# EAGLE design thermometer (EAGLE 7.2.0)
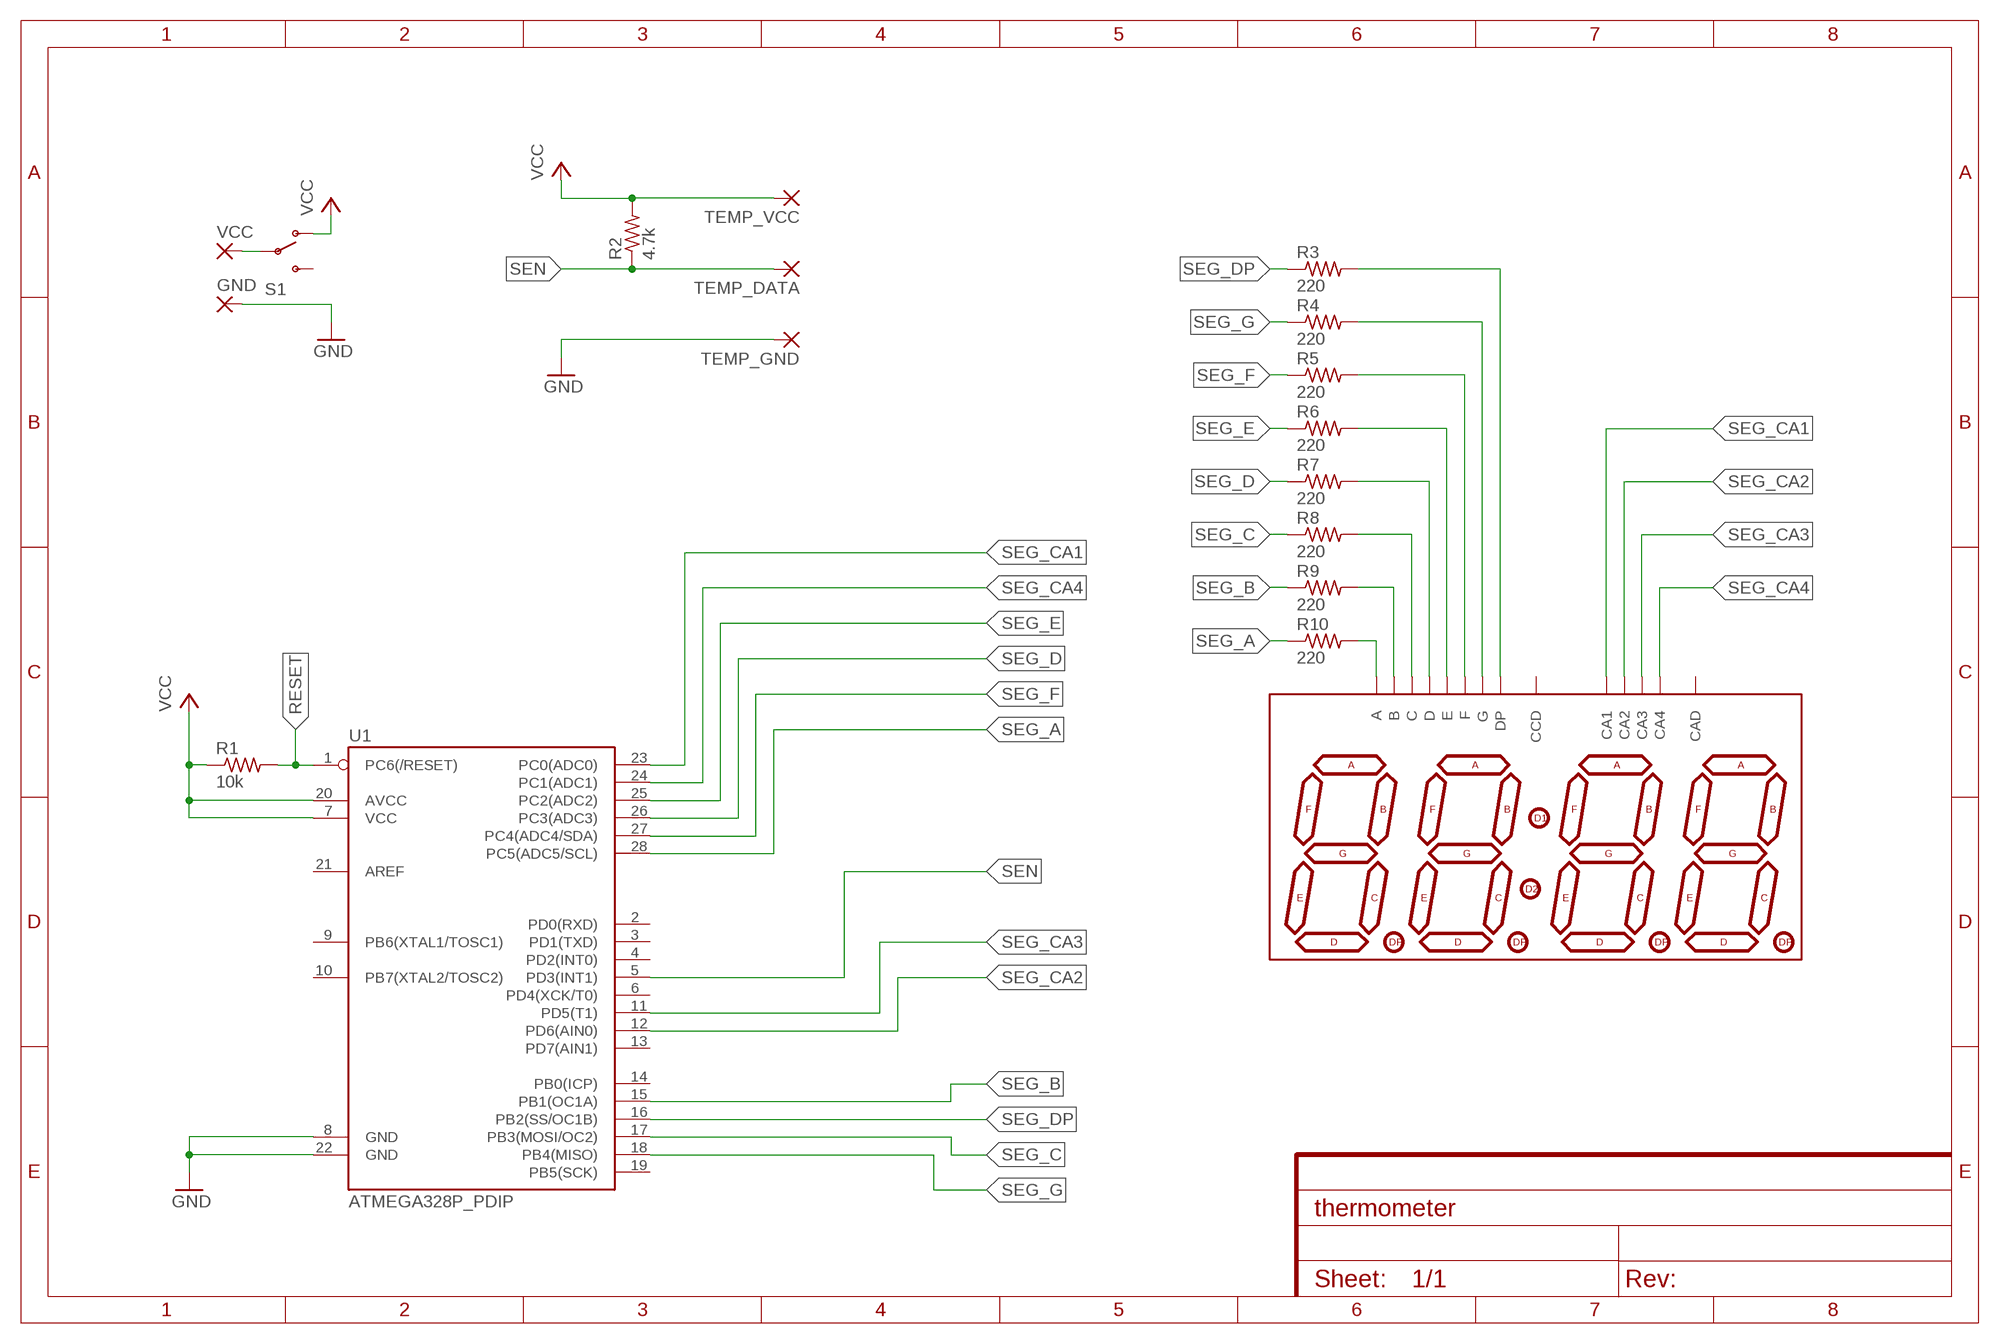
[diagram p0: schematic, sheet 1]
FRAME1 (FRAME-A4L): CNAME: Juraj Kostolansky; CREVISION: A; DESIGNER: www.kostolansky.sk

## Parts
GND  2,54/0,8  [2,54/0,8]
R1  10k  R-US_R0805  [R0805]
R2  4.7k  R-US_R0805  [R0805]
R3  220  R-US_R0805  [R0805]
R4  220  R-US_R0805  [R0805]
R5  220  R-US_R0805  [R0805]
R6  220  R-US_R0805  [R0805]
R7  220  R-US_R0805  [R0805]
R8  220  R-US_R0805  [R0805]
R9  220  R-US_R0805  [R0805]
R10  220  R-US_R0805  [R0805]
S1  SWITCH-SPDTPTH  [SWITCH-SPDT]
TEMP_DATA  2,54/0,8  [2,54/0,8]
TEMP_GND  2,54/0,8  [2,54/0,8]
TEMP_VCC  2,54/0,8  [2,54/0,8]
U1  ATMEGA328P_PDIP  [DIL28-3]
U2  5461BSDIP14  [5461BS]
VCC  2,54/0,8  [2,54/0,8]

## Nets
GND: GND.1(P) TEMP_GND.1(P) U1.8(GND) U1.22(GND)
N$1: R10.2 U2.A
N$2: R9.2 U2.B
N$3: R7.2 U2.D
N$4: R8.2 U2.C
N$5: R6.2 U2.E
N$6: R5.2 U2.F
N$7: R4.2 U2.G
N$8: R3.2 U2.DP
N$10: S1.2(P) VCC.1(P)
RESET: R1.2 U1.1(PC6(/RESET))
SEG_A: R10.1 U1.28(PC5(ADC5/SCL))
SEG_B: R9.1 U1.15(PB1(OC1A))
SEG_C: R8.1 U1.17(PB3(MOSI/OC2))
SEG_CA1: U1.23(PC0(ADC0)) U2.CA1
SEG_CA2: U1.12(PD6(AIN0)) U2.CA2
SEG_CA3: U1.11(PD5(T1)) U2.CA3
SEG_CA4: U1.24(PC1(ADC1)) U2.CA4
SEG_D: R7.1 U1.26(PC3(ADC3))
SEG_DP: R3.1 U1.16(PB2(SS/OC1B))
SEG_E: R6.1 U1.25(PC2(ADC2))
SEG_F: R5.1 U1.27(PC4(ADC4/SDA))
SEG_G: R4.1 U1.18(PB4(MISO))
SEN: R2.1 TEMP_DATA.1(P) U1.5(PD3(INT1))
VCC: R1.1 R2.2 S1.1(O) TEMP_VCC.1(P) U1.7(VCC) U1.20(AVCC)
Unconnected: S1.3(S) U1.2(PD0(RXD)) U1.3(PD1(TXD)) U1.4(PD2(INT0)) U1.6(PD4(XCK/T0)) U1.9(PB6(XTAL1/TOSC1)) U1.10(PB7(XTAL2/TOSC2)) U1.13(PD7(AIN1)) U1.14(PB0(ICP)) U1.19(PB5(SCK)) U1.21(AREF) U2.CAD U2.CCD

## Library data of the parts
GND TEMP_DATA TEMP_GND TEMP_VCC VCC = wirepad:2,54/0,8: THROUGH-HOLE PAD
R1-R10 = rcl:R-US_: RESISTOR, American symbol
S1 = SparkFun-Electromechanical:SWITCH-SPDT: SPDT Switch Simple slide switch, Spark Fun Electronics SKU : COM-00102 DPDT SMT slide switch, AYZ0202, SWCH-08179
U1 = SparkFun-DigitalIC:ATMEGA328P_PDIP: uC used in the Arduino 32kb flash, 1k EEPROM, 2k SRAM This is the through-hole version of this chip.
U2 = display:5461BS

## Board
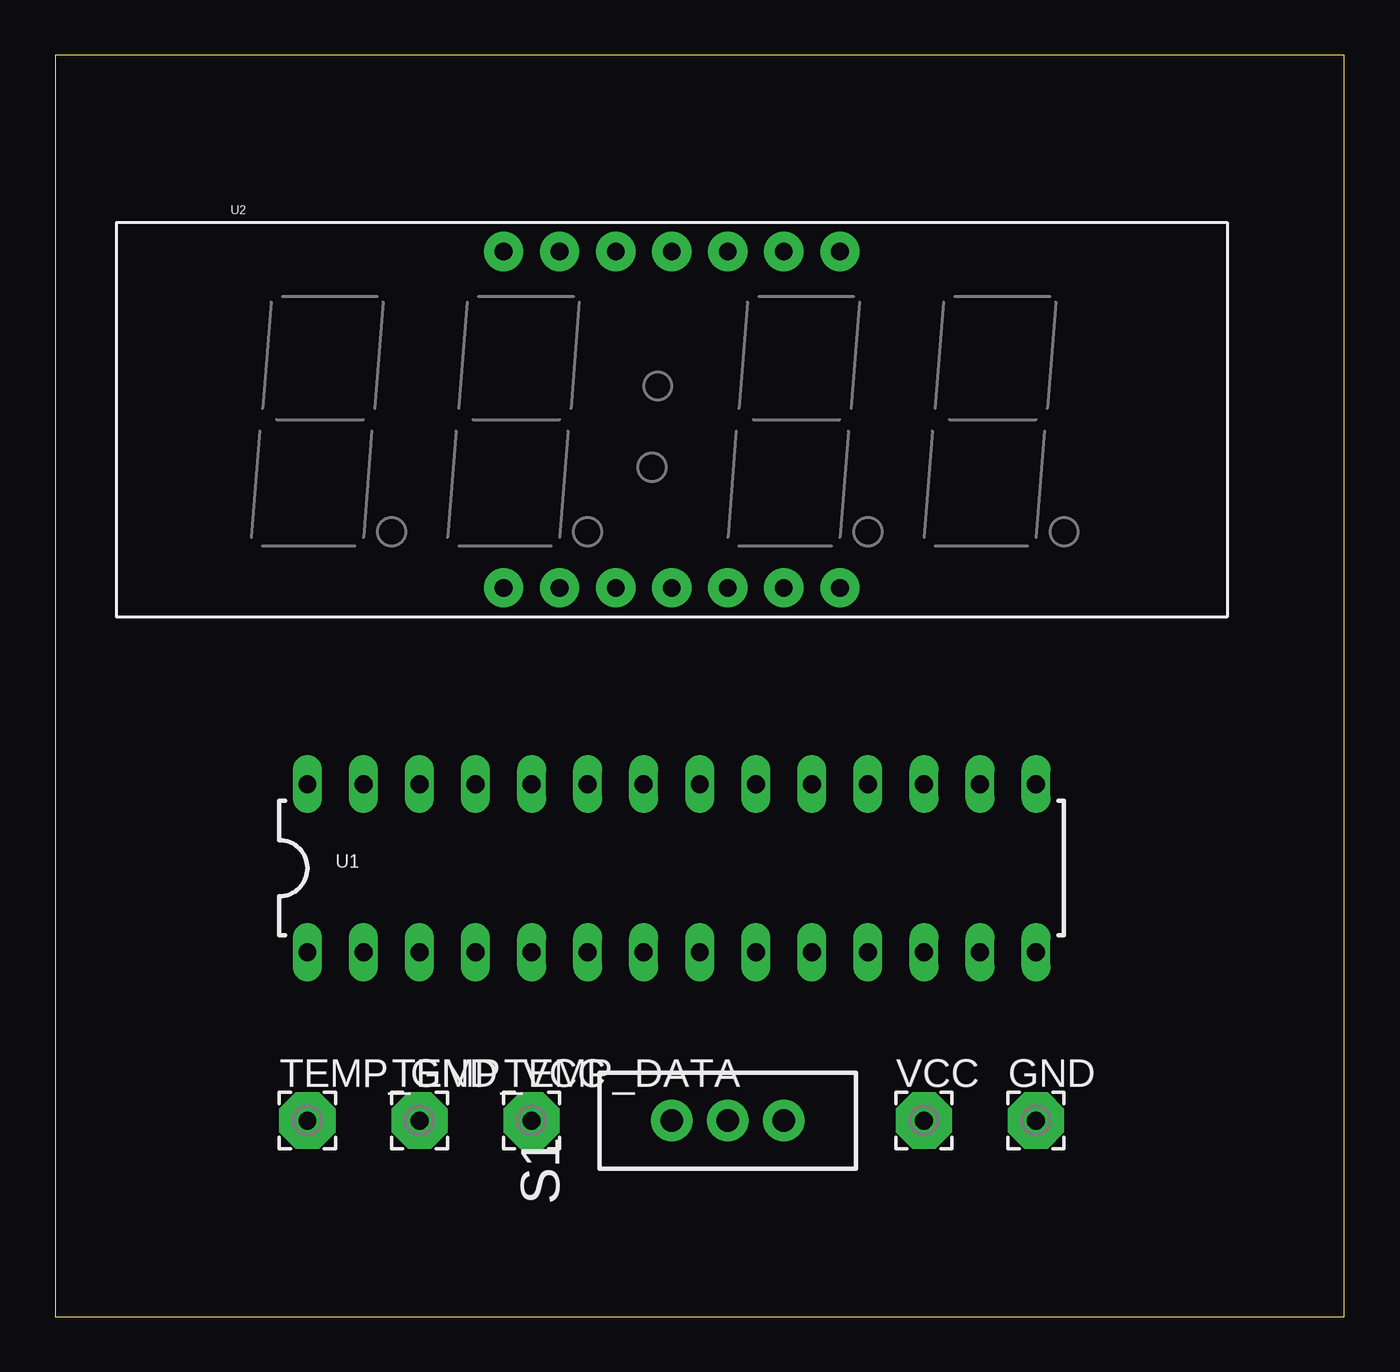
[diagram p1: board, top side]
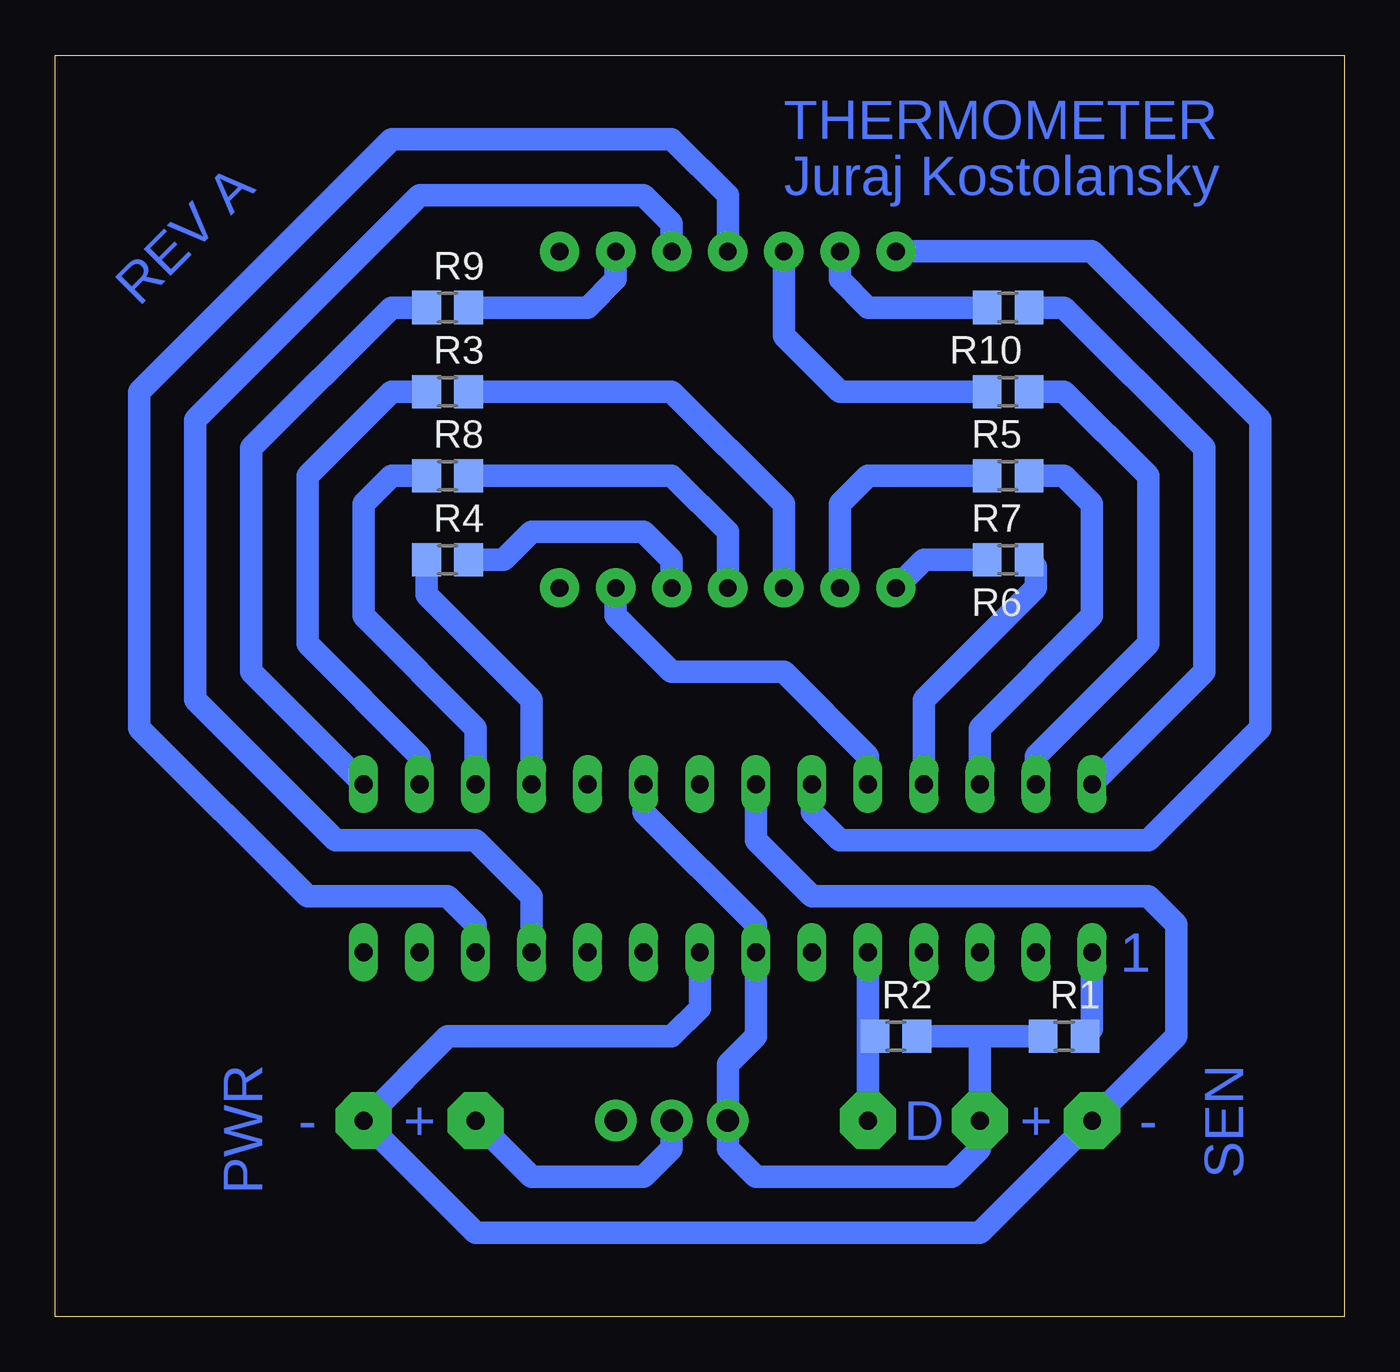
[diagram p2: board, bottom side, seen from below]

Size 58.42 x 57.15 mm. Coordinates in mm from the lower left corner, seen from the top.
Outline: 0,0 58.42,0 58.42,57.15 0,57.15 0,0
Copper layers (1*16): Top 0.035mm / dielectric 1.5mm / Bottom 0.035mm
Design rules "default *": minimum track width 16mil, minimum drill 24mil, track to track 16mil, track to pad 16mil, pad to pad 16mil, via to via 16mil, smd to smd 8mil, copper to edge 40mil, drill to drill 8mil, minimum pad ring 10mil, minimum via ring 8mil, stop-mask expansion 4mil, vias tented up to drill 0mil, thermal gap 10mil

### Footprints (pad centres in the part's own frame; a part is rotated, then mirrored left to right if it is on the bottom)
2,54/0,8 = drill 0.813 pad 2.54 octagon: 1 0,0
R0805 = smd 1.3 x 1.5: 1 -0.95,0; 2 0.95,0
SWITCH-SPDT = drill 1.016 pad 1.88: 1 0,2.54; 2 0,0; 3 0,-2.54
DIL28-3 = drill 0.813 long: 1 -16.51,-3.81; 2 -13.97,-3.81; 3 -11.43,-3.81; 4 -8.89,-3.81; 5 -6.35,-3.81; 6 -3.81,-3.81; 7 -1.27,-3.81; 8 1.27,-3.81; 9 3.81,-3.81; 10 6.35,-3.81; 11 8.89,-3.81; 12 11.43,-3.81; 13 13.97,-3.81; 14 16.51,-3.81; 15 16.51,3.81; 16 13.97,3.81; 17 11.43,3.81; 18 8.89,3.81; 19 6.35,3.81; 20 3.81,3.81; 21 1.27,3.81; 22 -1.27,3.81; 23 -3.81,3.81; 24 -6.35,3.81; 25 -8.89,3.81; 26 -11.43,3.81; 27 -13.97,3.81; 28 -16.51,3.81
5461BS = drill 0.8 pad 1.778: A -5.08,7.62; B 5.08,7.62; C 0,-7.62; CA1 -7.62,7.62; CA2 0,7.62; CA3 2.54,7.62; CA4 5.08,-7.62; CAD 7.62,-7.62; CCD 7.62,7.62; D -5.08,-7.62; DP -2.54,-7.62; E -7.62,-7.62; F -2.54,7.62; G 2.54,-7.62

### Placement (x,y rotation side)
GND  44.45,8.89 0 top
R1  12.7,12.7 0 bottom
R2  20.32,12.7 0 bottom
R3  40.64,41.91 0 bottom
R4  40.64,34.29 0 bottom
R5  15.24,41.91 180 bottom
R6  15.24,34.29 180 bottom
R7  15.24,38.1 180 bottom
R8  40.64,38.1 0 bottom
R9  40.64,45.72 0 bottom
R10  15.24,45.72 180 bottom
S1  30.48,8.89 90 top
TEMP_DATA  21.59,8.89 0 top
TEMP_GND  11.43,8.89 0 top
TEMP_VCC  16.51,8.89 0 top
U1  27.94,20.32 0 top
U2  27.94,40.64 0 top
VCC  39.37,8.89 0 top

### Tracks (layer width: path | path; a pad name or v marks a point on that pad's centre or on a via)
GND
  Bottom 1.016: U1.8 29.21,13.97 30.48,12.7 40.64,12.7 GND.1 39.37,3.81 16.51,3.81 TEMP_GND.1 7.62,12.7 7.62,17.78 8.89,19.05 24.13,19.05 26.67,21.59 U1.22
N$1
  Bottom 1.016: U2.A 22.86,46.99 21.59,45.72 R10.2
N$2
  Bottom 1.016: U2.B 33.02,46.99 34.29,45.72 R9.2
N$3
  Bottom 1.016: U2.D 22.86,36.83 21.59,38.1 R7.2
N$4
  Bottom 1.016: U2.C 27.94,35.56 30.48,38.1 R8.2
N$5
  Bottom 1.016: U2.E 19.05,34.29 R6.2
N$6
  Bottom 1.016: U2.F 25.4,44.45 22.86,41.91 R5.2
N$7
  Bottom 1.016: U2.G 30.48,34.29 31.75,35.56 36.83,35.56 38.1,34.29 R4.2
N$8
  Bottom 1.016: U2.DP 25.4,36.83 30.48,41.91 R3.2
N$10
  Bottom 1.016: VCC.1 36.83,6.35 31.75,6.35 30.48,7.62 S1.2
RESET
  Bottom 0.61: 11.43,13.02 R1.2
  Bottom 1.016: U1.1 11.43,13.02
SEG_A
  Bottom 1.016: R10.1 12.7,45.72 6.35,39.37 6.35,29.21 U1.28
SEG_B
  Bottom 1.016: U1.15 49.53,29.21 49.53,39.37 43.18,45.72 R9.1
SEG_C
  Bottom 1.016: U1.17 39.37,26.67 44.45,31.75 44.45,36.83 43.18,38.1 R8.1
SEG_CA1
  Bottom 1.016: U2.CA1 11.43,48.26 3.81,40.64 3.81,26.67 8.89,21.59 22.86,21.59 24.13,22.86 U1.23
SEG_CA2
  Bottom 1.016: U2.CA2 27.94,50.8 30.48,53.34 43.18,53.34 54.61,41.91 54.61,26.67 46.99,19.05 40.64,19.05 39.37,17.78 U1.12
SEG_CA3
  Bottom 1.016: U2.CA3 30.48,49.53 31.75,50.8 41.91,50.8 52.07,40.64 52.07,27.94 45.72,21.59 39.37,21.59 36.83,19.05 U1.11
SEG_CA4
  Bottom 1.016: U2.CA4 33.02,31.75 30.48,29.21 25.4,29.21 21.59,25.4 U1.24
SEG_D
  Bottom 1.016: U1.26 16.51,26.67 11.43,31.75 11.43,36.83 12.7,38.1 R7.1
SEG_DP
  Bottom 1.016: U1.16 41.91,25.4 46.99,30.48 46.99,38.1 43.18,41.91 R3.1
SEG_E
  Bottom 1.016: U1.25 19.05,27.94 13.97,33.02 13.97,33.97 R6.1
SEG_F
  Bottom 1.016: R5.1 12.7,41.91 8.89,38.1 8.89,30.48 13.97,25.4 U1.27
SEG_G
  Bottom 1.016: R4.1 41.59,32.7 36.83,27.94 U1.18
SEN
  Bottom 0.61: R2.1 21.59,12.7
  Bottom 1.016: TEMP_DATA.1 21.59,12.7 U1.5
VCC
  Bottom 1.016: R1.1 16.51,12.7 | 16.51,12.7 R2.2 | 16.51,12.7 TEMP_VCC.1 16.51,7.62 17.78,6.35 26.67,6.35 27.94,7.62 S1.1 27.94,11.43 26.67,12.7 U1.7 26.67,17.78 31.75,22.86 U1.20

### Text on the board
Bottom: THERMOMETER | Juraj Kostolansky | REV A | 1 | SEN | PWR | - | + | D | + | -